# Altium schematic sheet NFC.SchDoc
size A3
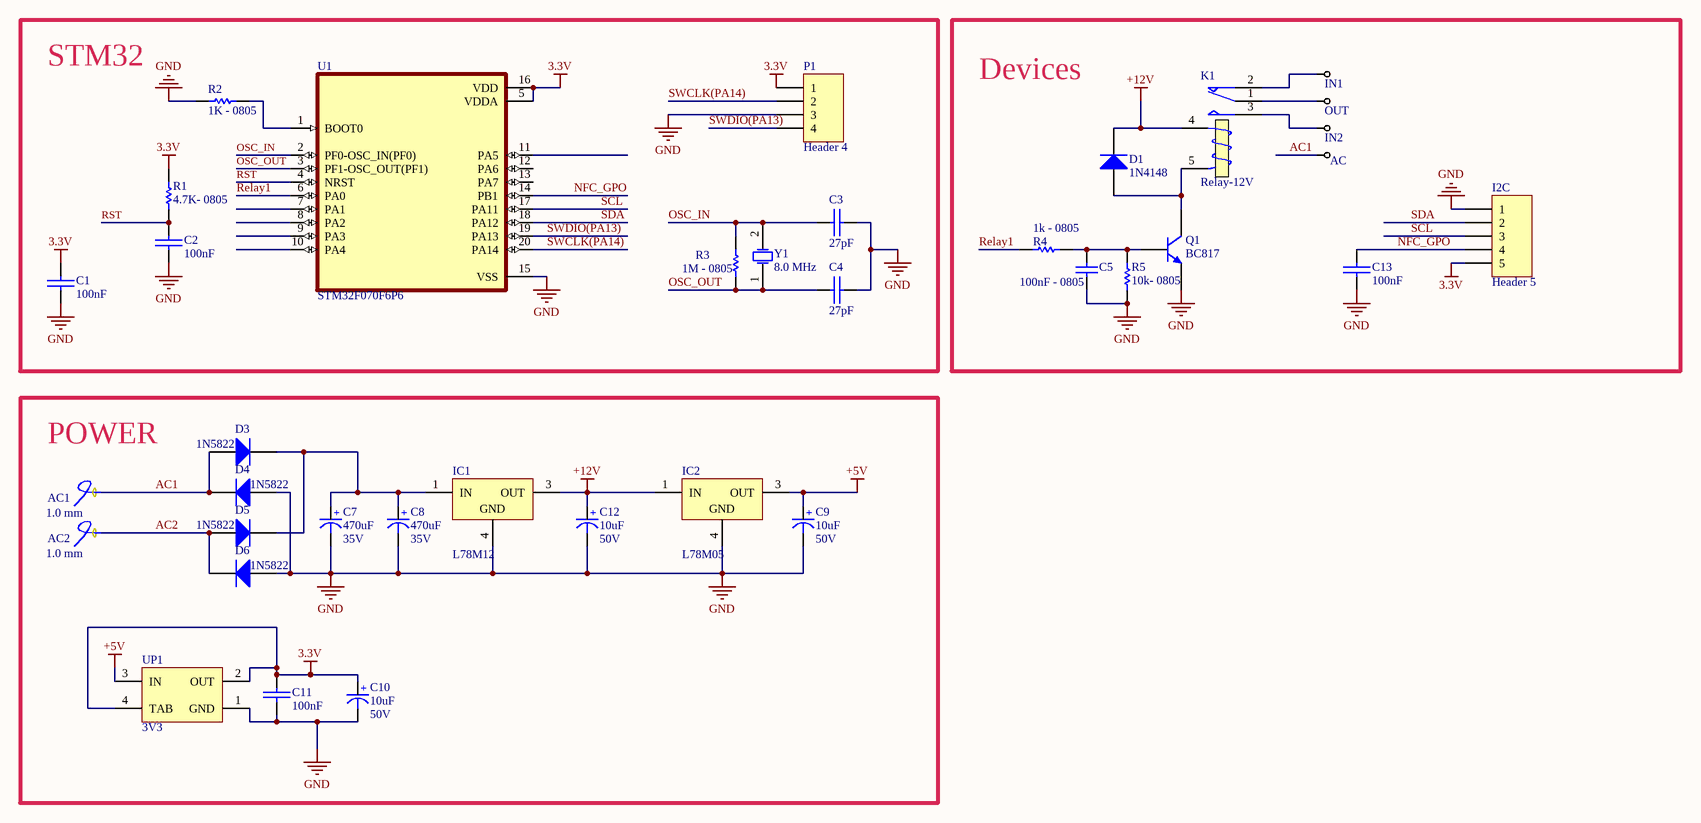
[diagram p0: NFC.SchDoc]

## Parts
AC  Test Point  [Test Point]  (value not drawn)
AC1  Diameter: 1.0 mm  [wire 2.0 mm]  (hidden comment: *)
AC2  Diameter: 1.0 mm  [wire 2.0 mm]  (hidden comment: *)
C1  100nF  [SMD_CAP_0805]
C2  100nF  [SMD_CAP_0805]
C3  27pF  [SMD_CAP_0805]
C4  27pF  [SMD_CAP_0805]
C5  100nF - 0805  [SMD_CAP_0805]
C7  Voltage: 35V  [cap 02]  (hidden comment: 470uF)
C8  Voltage: 35V  [cap 02]  (hidden comment: 470uF)
C9  Voltage: 50V  [cap 01]  (hidden comment: 10uF)
C10  Voltage: 50V  [cap 01]  (hidden comment: 10uF)
C11  100nF  [SMD_CAP_0805]
C12  Voltage: 50V  [cap 01]  (hidden comment: 10uF)
C13  100nF  [SMD_CAP_0805]
D1  1N4148  [LL4148]
D3  1N5822  [Diode 1N4007 SMD]
D4  1N5822  [Diode 1N4007 SMD]
D5  1N5822  [Diode 1N4007 SMD]
D6  1N5822  [Diode 1N4007 SMD]
I2C  Header 5  [HDR1X5]
IC1  L78M12  [TO-252]
IC2  L78M05  [TO-252]
IN1  Test Point  [Test Point]  (value not drawn)
IN2  Test Point  [Test Point]  (value not drawn)
K1  Relay-12V  [Relay 15.40x12.10x13.10]
OUT  Test Point  [Test Point]  (value not drawn)
P1  Header 4  [HDR1X4]
Q1  BC817  [SOT23_N]
R1  4.7K- 0805  [RES 0805 (2012X06L)]
R2  1K - 0805  [RES 0805 (2012X06L)]
R3  1M - 0805  [RES 0805 (2012X06L)]
R4  1k - 0805  [RES 0805 (2012X06L)]
R5  10k- 0805  [RES 0805 (2012X06L)]
U1  STM32F070F6P6  [SOP65P640X120-20N]
UP1  3V3  [SOT223]
Y1  8.0 MHz  [Crystal SMD]

## Blocks framed on the sheet
STM32: C1-C4 P1 R1-R3 U1 Y1
Devices: AC C5 C13 D1 I2C IN1 IN2 K1 OUT Q1 R4 R5
POWER: AC1 AC2 C7-C12 D3-D6 IC1 IC2 UP1

## Nets
3.3V: C1.2(-) C10.1(+) C11.1(+) I2C.5 P1.1 R1.1 U1.5(VDDA) U1.16(VDD) UP1.2(OUT) UP1.4(TAB)
+5V: C9.1(+) IC2.3(OUT) UP1.3(IN)
+12V: C12.1(+) D1.2(K) IC1.3(OUT) IC2.1(IN) K1.4(T1)
GND: C1.1(+) C2.1(+) C3.2(-) C4.2(-) C5.1 C7.2(-) C8.2(-) C9.2(-) C10.2(-) C11.2(-) C12.2(-) C13.1(+) D4.1(A) D6.1(A) I2C.1 IC1.4(GND) IC2.4(GND) P1.3 Q1.2(E) R2.2 R5.2 U1.15(VSS) UP1.1(GND)
AC1: AC.1(T) AC1.1(W) D3.1(A) D4.2(K)
AC2: AC2.1(W) D5.1(A) D6.2(K)
NFC_GPO: C13.2(-) I2C.4 U1.14(PB1)
OSC_IN: C3.1(+) R3.2 U1.2(PF0-OSC_IN(PF0)) Y1.2(OSC2)
OSC_OUT: C4.1(+) R3.1 U1.3(PF1-OSC_OUT(PF1)) Y1.1(OSC1)
Relay1: R4.2 U1.6(PA0)
RST: C2.2(-) R1.2 U1.4(NRST)
SCL: I2C.3 U1.17(PA11)
SDA: I2C.2 U1.18(PA12)
SWCLK(PA14): P1.2 U1.20(PA14)
SWDIO(PA13): P1.4 U1.19(PA13)
NetC5_2: C5.2 Q1.1(B) R4.1 R5.1
NetC7_1: C7.1(+) C8.1(+) D3.2(K) D5.2(K) IC1.1(IN)
NetD1_1: D1.1(A) K1.5(T2) Q1.3(C)
NetIN1_1: IN1.1(T) K1.2(NC)
NetIN2_1: IN2.1(T) K1.3(NO)
NetK1_1: K1.1(COM) OUT.1(T)
NetR2_1: R2.1 U1.1(BOOT0)

Not connected (* = marked no-connect by the designer): U1 7(PA1) 8(PA2) 9(PA3) 10(PA4) 11(PA5) 12(PA6) 13(PA7)

## Library data of the parts
AC1 AC2 = Single Wire: A Customize Component For Single Wire Connection; Designer: Saeid Jorablo; Company: IPA Co; Adding Date: 1388/04/05; Color: Blue; Wire Name: *
C1-C4 C11 C13 = Cap-Bipolar: Bipolar Capacitor; Voltage: 100V; Designer: Saeid Jorablo; Organazation: ControTec; Adding Date: 1387/12/20
  C1 C2 C11 C13: Value: 100nF
  C3 C4: Value: 27pF
C5 = Cap: Capacitor; Value: 100pF; Published: 8-Jun-2000; LatestRevisionDate: 17-Jul-2002; LatestRevisionNote: Re-released for DXP Platform.; PackageReference: RAD-0.3; Publisher: Altium Limited; PackageDescription: Radial Cap, Thru-Hole; 2 Leads; 0.3 in Pin Spacing
C7-C10 C12 = Cap-Polar: Polar Capacitor; Designer: Saeid Jorablo; Organazation: ControTec; Adding Date: 1387/12/20
  C7 C8: Value: 470uF
  C9 C10 C12: Value: 10uF
D1 D3-D6 = Diode 1N4148: High Conductance Fast Diode; Published: 8-Jun-2000; LatestRevisionDate: 17-Jul-2002; LatestRevisionNote: Re-released for DXP Platform.; DatasheetVersion: 1997; PackageReference: DO-35; Publisher: Altium Limited; PackageDescription: Diode, Axial; Body 3.8 x 1.9 mm (LxDia. max), Lead Dia. 0.53 mm (max); Code_JEDEC: DO-204-AH; ComponentLink1Description: Manufacturer Link; ComponentLink1URL: http://www.fairchildsemi.com/; ComponentLink2Description: Datasheet; ComponentLink2URL: http://www.fairchildsemi.com/ds/1N%2F1N4148.pdf
I2C = Header 5: Header, 5-Pin; LatestRevisionDate: 17-Jul-2002; LatestRevisionNote: Re-released for DXP Platform.; Publisher: Altium Limited
IC1 IC2 = L78M05: Precision 500mA Regulator
K1 = Relay: SPDT Relay; Designer: Eng. Saeid Jorablo; Company: E.P.I.L; Design_Date: 2011/10/31
P1 = Header 4: Header, 4-Pin; LatestRevisionDate: 17-Jul-2002; LatestRevisionNote: Re-released for DXP Platform.; Publisher: Altium Limited
Q1 = BC817: 45 V, 500 mA NPN general-purpose transistors; Published: 2017-2-8; LatestRevisionDate: 2017; LatestRevisionNote: IPC-7351 Footprint Added.; DatasheetVersion: 2017; PackageVersion: 2017-2-8; PackageReference: SOT23; Publisher: Abbas Basereh; PackageDescription: 3-Pin SOT-23 Package 0.95 mm Pitch, 2.3 mm Lead Span; ComponentLink1Description: Manufacturer Link; ComponentLink1URL: http://www.nxp.com/; ComponentLink2Description: Datasheet; ComponentLink2URL: http://www.nxp.com/
R1-R5 = Res: Resistor; Value: 150; Published: 8-Jun-2000; LatestRevisionDate: 17-Jul-2002; LatestRevisionNote: Re-released for DXP Platform.; PackageReference: AXIAL-0.3; Publisher: Altium Limited; PackageDescription: Axial Device, Thru-Hole; 2 Leads; 0.3 in Pin Spacing
U1 = STM32F070F6P6: ARMÂ® CortexÂ®-M0 STM32F0 Microcontroller IC 32-Bit 48MHz 32KB _32K x 8_ FLASH 20-TSSOP; MF: STMicroelectronics; SnapEDA_Link: https://www.snapeda.com/parts/STM32F070F6P6/STMicroelectronics/view-part/423630/?ref=snap; Value: *; Digi-Key_Part_Number: 497-17354-2-ND; Digi-Key_Purchase_URL: https://www.digikey.com/product-detail/en/stmicroelectronics/STM32F070F6P6TR/497-17354-2-ND/7313047?utm_source=snapeda&utm_medium=aggregator&utm_campaign=symbol; MP: STM32F070F6P6; Package: TSSOP-20 STMicroelectronics
UP1 = AMS1117-x.x: x.x Volt, 800mA Low-Dropout Linear Regulator, 4-pin SOT-223; Designer: Ali Hafizi; Data: 16-12-2016
Y1 = XTAL: XTAL Crystal; Company: E.P.I.L; Design Date: 11/04/2011; Value: 8.0 MHz